# Altium schematic sheet ESP32_DevBoard_T.SchDoc
size A4
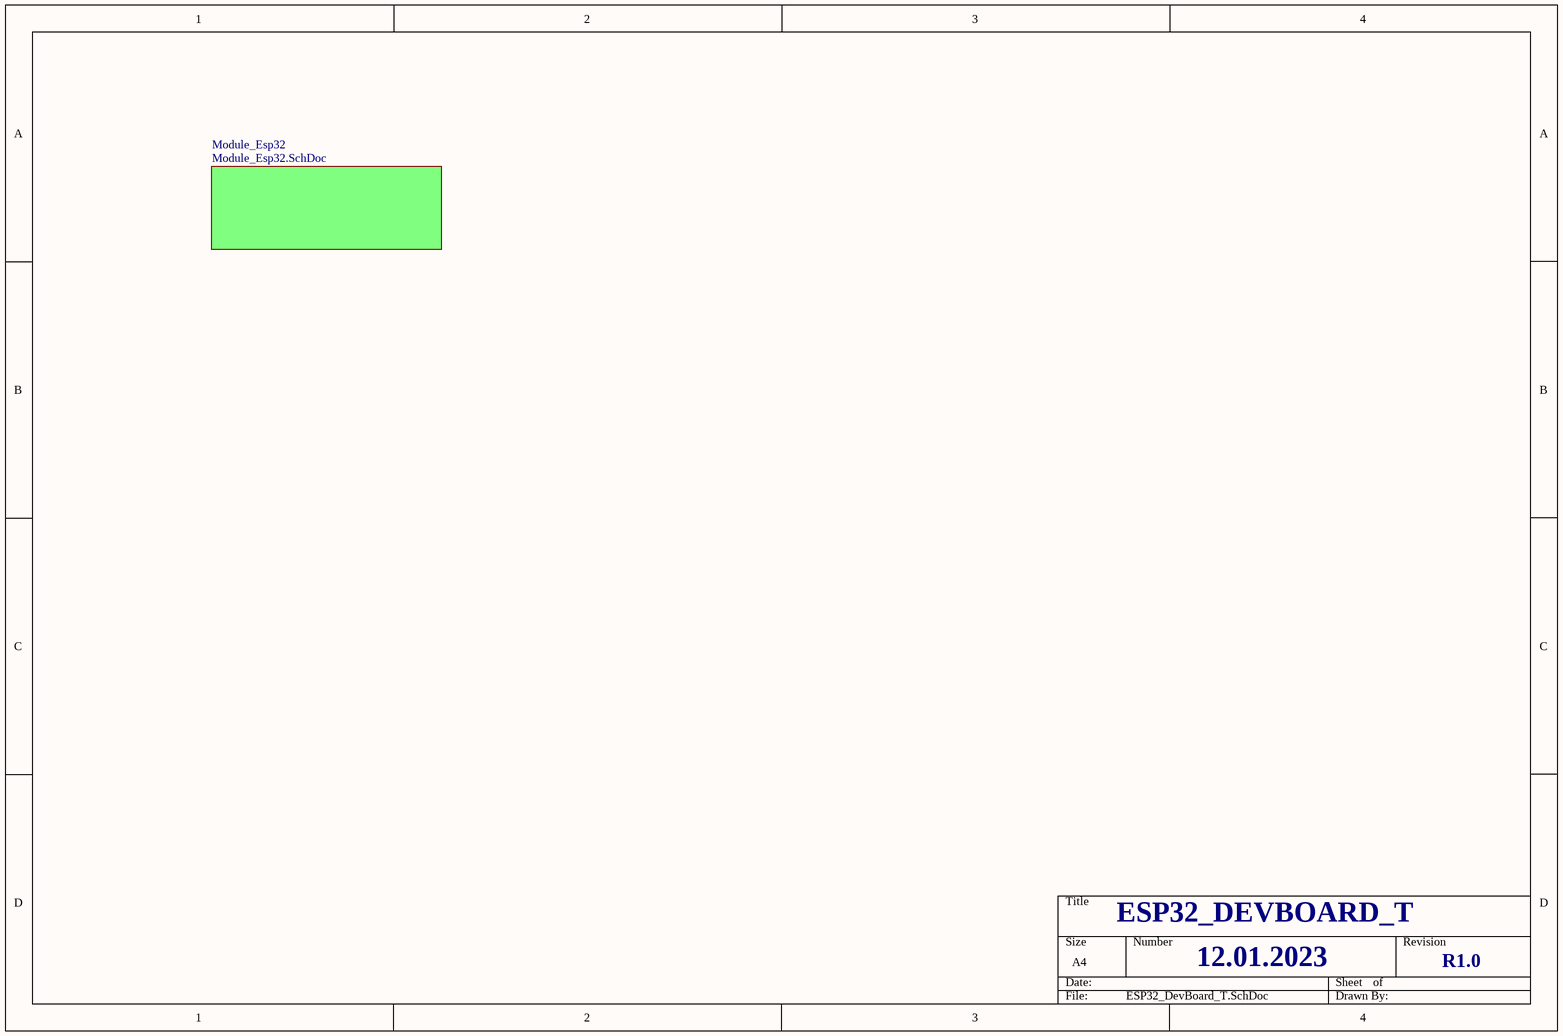
[diagram p0: ESP32_DevBoard_T.SchDoc]

## Sub-sheets
Module_Esp32 = Module_Esp32.SchDoc: no entries

## Notes on the sheet
- ESP32_DEVBOARD_T
- 12.01.2023
- R1.0